# Altium schematic sheet Display.SchDoc
size A; SheetNumber: 5; SheetTotal: 8
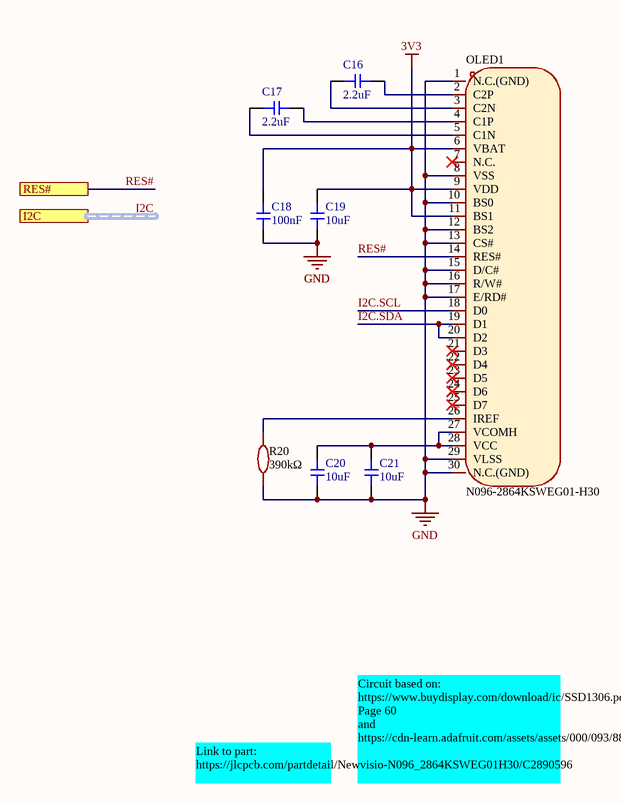
[diagram p0: Display.SchDoc]

## Parts
C16  Capacitance: 2.2uF  [CAP-0402]  (hidden comment: CL05A225MQ5NSNC)
C17  Capacitance: 2.2uF  [CAP-0402]  (hidden comment: CL05A225MQ5NSNC)
C18  Capacitance: 100nF  [CAP-0402]  (hidden comment: CL05B104KO5NNNC)
C19  Capacitance: 10uF  [CAP-0402]  (hidden comment: CL05A106MQ5NUNC)
C20  Capacitance: 10uF  [CAP-0402]  (hidden comment: CL05A106MQ5NUNC)
C21  Capacitance: 10uF  [CAP-0402]  (hidden comment: CL05A106MQ5NUNC)
OLED1  N096-2864KSWEG01-H30  [OLED_0.96-30P-P0.70-12864]
R20  390kΩ  [R0402]

## Ports
I2C (harness I2C, see STM32[1D]), RES# (see STM32[1D])

## Nets
3V3: C18.2 C19.2 OLED1.6(VBAT) OLED1.9(VDD) OLED1.11(BS1)
GND: C18.1 C19.1 C20.1 C21.1 OLED1.1(N.C.(GND)) OLED1.8(VSS) OLED1.10(BS0) OLED1.12(BS2) OLED1.13(CS#) OLED1.15(D/C#) OLED1.16(R/W#) OLED1.17(E/RD#) OLED1.29(VLSS) OLED1.30(N.C.(GND)) R20.1
I2C.SCL: OLED1.18(D0)
I2C.SDA: OLED1.19(D1) OLED1.20(D2)
RES#: OLED1.14(RES#) ; port RES#
NetC16_1: C16.1 OLED1.3(C2N)
NetC16_2: C16.2 OLED1.2(C2P)
NetC17_1: C17.1 OLED1.5(C1N)
NetC17_2: C17.2 OLED1.4(C1P)
NetC20_2: C20.2 C21.2 OLED1.27(VCOMH) OLED1.28(VCC)
NetOLED1_26: OLED1.26(IREF) R20.2

Not connected (* = marked no-connect by the designer): OLED1 7(N.C.)* 21(D3)* 22(D4)* 23(D5)* 24(D6)* 25(D7)*

## Buses and harness runs
harness I2C = port I2C

## Notes on the sheet
- Link to part:
  https://jlcpcb.com/partdetail/Newvisio-N096_2864KSWEG01H30/C2890596
- Circuit based on:
  https://www.buydisplay.com/download/ic/SSD1306.pdf
  Page 60
  and
  https://cdn-learn.adafruit.com/assets/assets/000/093/884/original/adafruit_products_0-96in_OLED_sch.png?1596746114

## Library data of the parts
C16 C17 = CL05A225MQ5NSNC: Capacitor, Ceramic (MLCC), 2.2uF, ±20%, 6.3V, X5R, ±20%, SMD 0402; Manufacturer: Samsung Electro-Mechanics; Temperature Rating: -55°C ~ 85°C; Capacitance @ 1V DC Bias: 2.019uF; Capacitance @ 1.2V DC Bias: 1.921uF; Capacitance @ 1.35V DC Bias: 1.843uF; Capacitance @ 1.5V DC Bias: 1.764uF; Capacitance @ 1.8V DC Bias: 1.611uF; Capacitance @ 2.5V DC Bias: 1.302uF; Capacitance @ 3.3V DC Bias: 1.004uF; Capacitance @ 3.7V DC Bias: 0.893uF; Capacitance @ 4.2V DC Bias: 0.780uF; Capacitance @ 5V DC Bias: 0.638uF; Impedance (0V Bias) @ 100Hz: 935Ω; Impedance (0V Bias) @ 500Hz: 192Ω; Impedance (0V Bias) @ 1kHz: 97.4Ω; Impedance (0V Bias) @ 5kHz: 20Ω; Impedance (0V Bias) @ 10kHz: 10.1Ω; Impedance (0V Bias) @ 50kHz: 2.08Ω; Impedance (0V Bias) @ 100kHz: 1.05Ω; Impedance (0V Bias) @ 500kHz: 0.214Ω; Impedance (0V Bias) @ 1MHz: 0.107Ω; Impedance (0V Bias) @ 5MHz: 0.0123Ω; Impedance (0V Bias) @ 10MHz: 0.0171Ω; Impedance (0V Bias) @ 50MHz: 0.0697Ω; Impedance (0V Bias) @ 100MHz: 0.123Ω; Impedance (0V Bias) @ 500MHz: 0.484Ω; Impedance (0V Bias) @ 1GHz: 0.858Ω; Impedance (0V Bias) @ 2GHz: 1.87Ω; Impedance (0V Bias) @ 5GHz: 3.69Ω; Package Size: 0402; JLCPCB Basic Part: Yes; JLCPCB Part Number: C12530; Supplier 1: LCSC; Category: Capacitors - MLCC; Supplier Part Number 1: C12530; Manufacturer Part Number: CL05A225MQ5NSNC; Tolerance: ±20%; Voltage Rating: 6.3V; Temperature Coefficient: X5R; RoHS: Yes; ComponentLink1Description: Datasheet; ComponentLink1URL: https://wmsc.lcsc.com/wmsc/upload/file/pdf/v2/lcsc/2304140030_Samsung-Electro-Mechanics-CL05A225MQ5NSNC_C12530.pdf; ComponentLink2Description: JLCPCB Part URL; ComponentLink2URL: https://jlcpcb.com/partdetail/C12530; ComponentLink3Description: LCSC Part URL; ComponentLink3URL: https://lcsc.com/product-detail/Multilayer-Ceramic-Capacitors-MLCC---SMD-SMT_Samsung-Electro-Mechanics-Samsung-Electro-Mechanics-CL05A225MQ5NSNC_C12530.html; ComponentLink4Description: Samsung Component Library; ComponentLink4URL: https://weblib.samsungsem.com/mlcc/mlcc-ec.do?partNumber=CL05A225MQ5NSN
C18 = CL05B104KO5NNNC: Capacitor, Ceramic (MLCC), 100nF, ±10%, 16V, X7R, ±10%, SMD 0402; Manufacturer: Samsung Electro-Mechanics; Temperature Rating: -55°C ~ 125°C; Capacitance @ 1V DC Bias: 104.721nF; Capacitance @ 1.2V DC Bias: 104.598nF; Capacitance @ 1.35V DC Bias: 104.495nF; Capacitance @ 1.5V DC Bias: 104.372nF; Capacitance @ 1.8V DC Bias: 104.042nF; Capacitance @ 2.5V DC Bias: 102.634nF; Capacitance @ 3.3V DC Bias: 100.452nF; Capacitance @ 3.7V DC Bias: 99.160nF; Capacitance @ 4.2V DC Bias: 97.441nF; Capacitance @ 5V DC Bias: 94.577nF; Capacitance @ 9V DC Bias: 78.638nF; Capacitance @ 12V DC Bias: 66.291nF; Capacitance @ 15V DC Bias: 54.779nF; Impedance (0V Bias) @ 100Hz: 1.71E+04Ω; Impedance (0V Bias) @ 500Hz: 3.48E+03Ω; Impedance (0V Bias) @ 1kHz: 1.75E+03Ω; Impedance (0V Bias) @ 5kHz: 356Ω; Impedance (0V Bias) @ 10kHz: 179Ω; Impedance (0V Bias) @ 50kHz: 36.4Ω; Impedance (0V Bias) @ 100kHz: 18.3Ω; Impedance (0V Bias) @ 500kHz: 3.72Ω; Impedance (0V Bias) @ 1MHz: 1.87Ω; Impedance (0V Bias) @ 5MHz: 0.373Ω; Impedance (0V Bias) @ 10MHz: 0.175Ω; Impedance (0V Bias) @ 50MHz: 0.064Ω; Impedance (0V Bias) @ 100MHz: 0.122Ω; Impedance (0V Bias) @ 500MHz: 0.525Ω; Impedance (0V Bias) @ 1GHz: 0.97Ω; Impedance (0V Bias) @ 2GHz: 2.26Ω; Impedance (0V Bias) @ 5GHz: 4.75Ω; Impedance (16V Bias) @ 100Hz: 2.55E+04Ω; Impedance (16V Bias) @ 500Hz: 5.18E+03Ω; Impedance (16V Bias) @ 1kHz: 2.61E+03Ω; Impedance (16V Bias) @ 5kHz: 529Ω; Impedance (16V Bias) @ 10kHz: 266Ω; Impedance (16V Bias) @ 50kHz: 54Ω; Impedance (16V Bias) @ 100kHz: 27.2Ω; Impedance (16V Bias) @ 500kHz: 5.5Ω; Impedance (16V Bias) @ 1MHz: 2.76Ω; Impedance (16V Bias) @ 5MHz: 0.587Ω; Impedance (16V Bias) @ 10MHz: 0.277Ω; Impedance (16V Bias) @ 50MHz: 0.0412Ω; Impedance (16V Bias) @ 100MHz: 0.133Ω; Impedance (16V Bias) @ 500MHz: 0.524Ω; Impedance (16V Bias) @ 1GHz: 0.969Ω; Impedance (16V Bias) @ 2GHz: 2.25Ω; Impedance (16V Bias) @ 5GHz: 4.7Ω; Package Size: 0402; JLCPCB Basic Part: Yes; JLCPCB Part Number: C1525; Supplier 1: LCSC; Category: Capacitors - MLCC; Supplier Part Number 1: C1525; Manufacturer Part Number: CL05B104KO5NNNC; Tolerance: ±10%; Voltage Rating: 16V; Temperature Coefficient: X7R; RoHS: Yes; ComponentLink1Description: Datasheet; ComponentLink1URL: https://wmsc.lcsc.com/wmsc/upload/file/pdf/v2/lcsc/2304140030_Samsung-Electro-Mechanics-CL05B104KO5NNNC_C1525.pdf; ComponentLink2Description: JLCPCB Part URL; ComponentLink2URL: https://jlcpcb.com/partdetail/C1525; ComponentLink3Description: LCSC Part URL; ComponentLink3URL: https://lcsc.com/product-detail/Multilayer-Ceramic-Capacitors-MLCC---SMD-SMT_Samsung-Electro-Mechanics-Samsung-Electro-Mechanics-CL05B104KO5NNNC_C1525.html; ComponentLink4Description: Samsung Component Library; ComponentLink4URL: https://weblib.samsungsem.com/mlcc/mlcc-ec.do?partNumber=CL05B104KO5NNN
C19-C21 = CL05A106MQ5NUNC: Capacitor, Ceramic (MLCC), 10uF, ±20%, 6.3V, X5R, ±20%, SMD 0402; Manufacturer: Samsung Electro-Mechanics; Temperature Rating: -55°C ~ 85°C; Capacitance @ 1V DC Bias: 7.816uF; Capacitance @ 1.2V DC Bias: 7.392uF; Capacitance @ 1.35V DC Bias: 7.025uF; Capacitance @ 1.5V DC Bias: 6.639uF; Capacitance @ 1.8V DC Bias: 5.875uF; Capacitance @ 2.5V DC Bias: 4.552uF; Capacitance @ 3.3V DC Bias: 3.499uF; Capacitance @ 3.7V DC Bias: 3.122uF; Capacitance @ 4.2V DC Bias: 2.720uF; Capacitance @ 5V DC Bias: 2.236uF; Impedance (0V Bias) @ 100Hz: 243Ω; Impedance (0V Bias) @ 500Hz: 50Ω; Impedance (0V Bias) @ 1kHz: 25.3Ω; Impedance (0V Bias) @ 5kHz: 5.23Ω; Impedance (0V Bias) @ 10kHz: 2.64Ω; Impedance (0V Bias) @ 50kHz: 0.544Ω; Impedance (0V Bias) @ 100kHz: 0.275Ω; Impedance (0V Bias) @ 500kHz: 0.0554Ω; Impedance (0V Bias) @ 1MHz: 0.026Ω; Impedance (0V Bias) @ 5MHz: 0.012Ω; Impedance (0V Bias) @ 10MHz: 0.0181Ω; Impedance (0V Bias) @ 50MHz: 0.0531Ω; Impedance (0V Bias) @ 100MHz: 0.09Ω; Impedance (0V Bias) @ 500MHz: 0.323Ω; Impedance (0V Bias) @ 1GHz: 0.567Ω; Impedance (0V Bias) @ 2GHz: 1.33Ω; Impedance (0V Bias) @ 5GHz: 2.66Ω; Package Size: 0402; JLCPCB Basic Part: Yes; JLCPCB Part Number: C15525; Supplier 1: LCSC; Category: Capacitors - MLCC; Supplier Part Number 1: C15525; Manufacturer Part Number: CL05A106MQ5NUNC; Tolerance: ±20%; Voltage Rating: 6.3V; Temperature Coefficient: X5R; RoHS: Yes; ComponentLink1Description: Datasheet; ComponentLink1URL: https://wmsc.lcsc.com/wmsc/upload/file/pdf/v2/lcsc/2208231630_Samsung-Electro-Mechanics-CL05A106MQ5NUNC_C15525.pdf; ComponentLink2Description: JLCPCB Part URL; ComponentLink2URL: https://jlcpcb.com/partdetail/C15525; ComponentLink3Description: LCSC Part URL; ComponentLink3URL: https://lcsc.com/product-detail/Multilayer-Ceramic-Capacitors-MLCC---SMD-SMT_Samsung-Electro-Mechanics-Samsung-Electro-Mechanics-CL05A106MQ5NUNC_C15525.html; ComponentLink4Description: Samsung Component Library; ComponentLink4URL: https://weblib.samsungsem.com/mlcc/mlcc-ec.do?partNumber=CL05A106MQ5NUN
OLED1 = N096-2864KSWEG01-H30: Manufacturer: Newvision(新智景); Add into BOM: yes; Main Control Chip: SSD1306; Symbol: N096-2864KSWEG01-H30; Device: N096-2864KSWEG01-H30; LCSC Part Name: 0.96寸 白色 128x64像素分辨率 单色 30PIN; Supplier Part: C2890596; Manufacturer Part: N096-2864KSWEG01-H30; Supplier Footprint: -; JLCPCB Part Class: Extended Part; Supplier: LCSC; Convert to PCB: yes; Size: 0.96
R20 = 0402WGF3903TCE: 390k Resistor; Manufacturer: UNI-ROYAL(厚声); Add into BOM: yes; Tolerance: ±1%; Temperature Coefficient: ±100ppm/℃; Symbol: 0402WGF3903TCE; Device: 0402WGF3903TCE; LCSC Part Name: 390kΩ ±1% 62.5mW 厚膜电阻; Supplier Part: C25782; Manufacturer Part: 0402WGF3903TCE; Supplier Footprint: 0402; JLCPCB Part Class: Extended Part; Datasheet: https://atta.szlcsc.com/upload/public/pdf/source/20200306/C422600_1E6D84923E4A46A82E41ADD87F860B5C.pdf; Supplier: LCSC; Convert to PCB: yes; Type: Thick Film Resistors; Operating Temperature Range: -55℃~+155℃; Value: 390kΩ